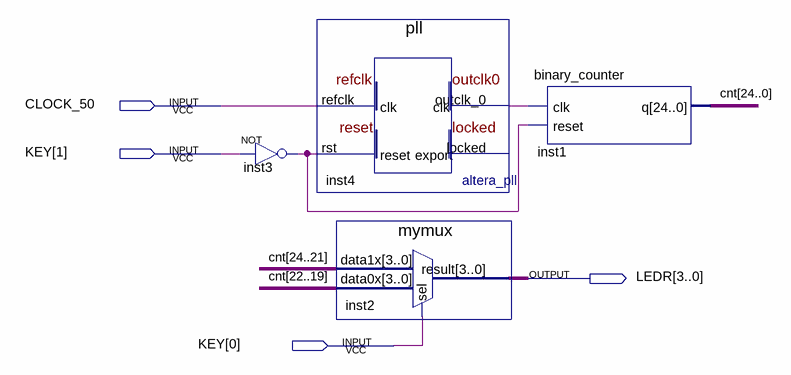
[diagram p0: schematic sheet]
// Quartus schematic MyFirstFPGA.bdf as structural Verilog: 4 symbols, 4 pins
module MyFirstFPGA (
  input  CLOCK_50,
  input  [1:0] KEY,
  output [3:0] LEDR
);

  wire inst3_out, inst4_outclk_0;
  wire [24:0] cnt;

  not inst3 (inst3_out, KEY[1]);
  pll inst4 (.refclk(CLOCK_50), .rst(inst3_out), .outclk_0(inst4_outclk_0));  // open: locked
  mymux inst2 (.data1x(cnt[24:21]), .data0x(cnt[22:19]), .sel(KEY[0]), .result(LEDR));
  binary_counter inst1 (.clk(inst4_outclk_0), .reset(inst3_out), .q(cnt));
endmodule
